# Altium schematic sheet Display.SchDoc
size A4; SheetNumber: 3; SheetTotal: 5
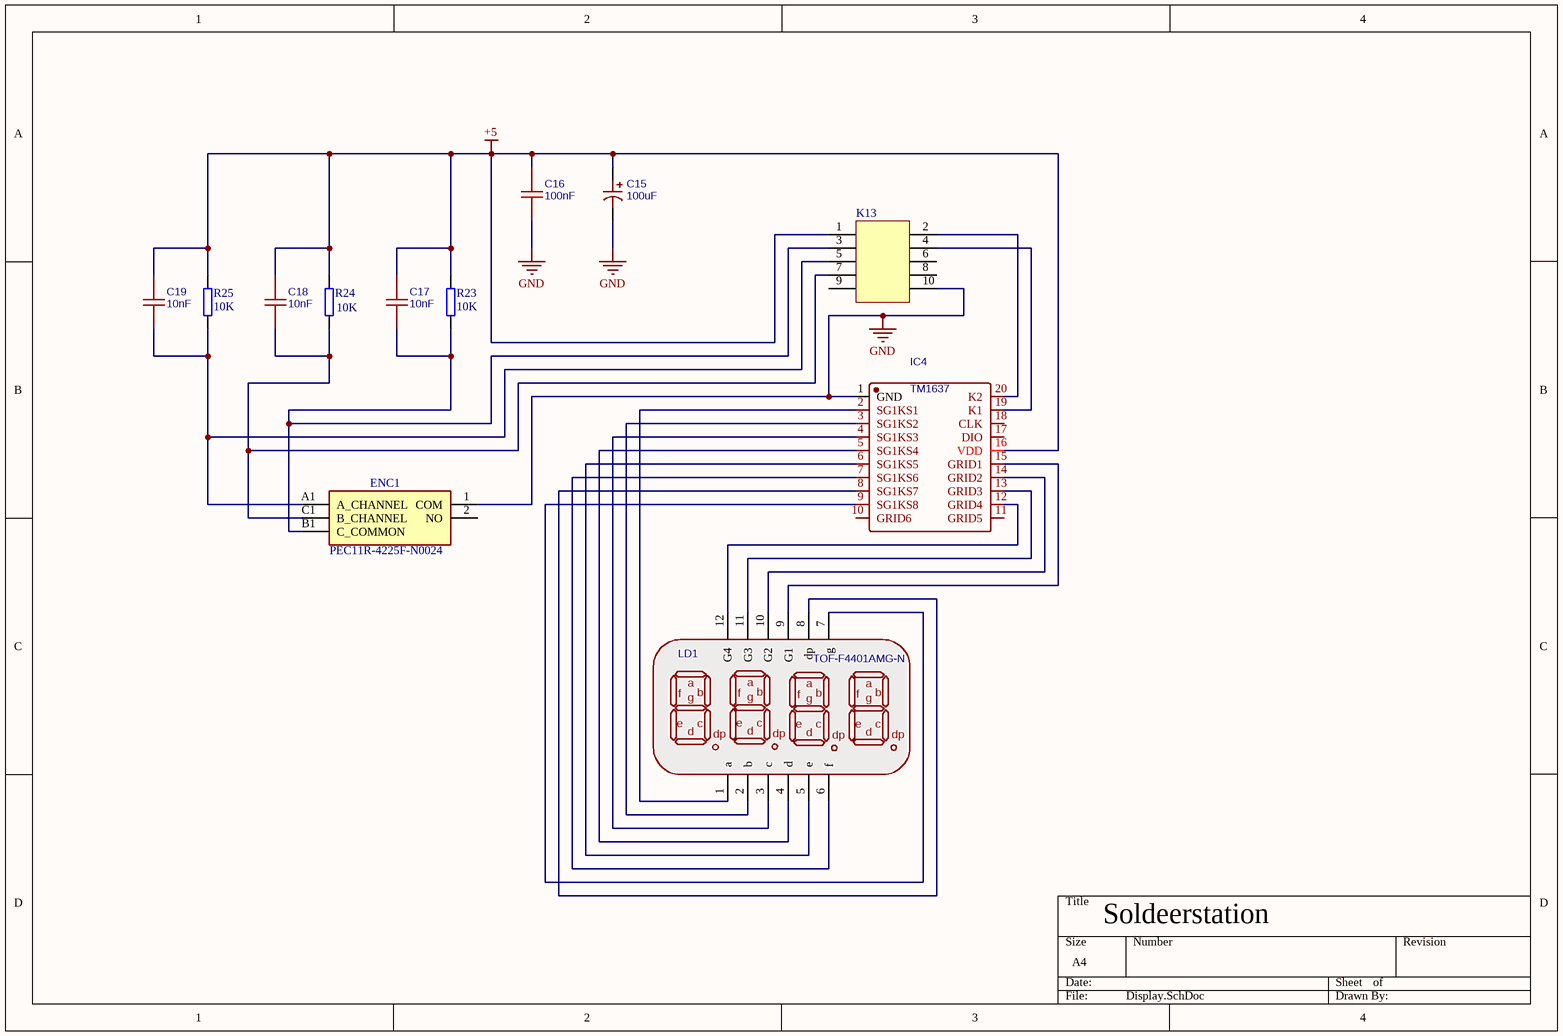
[diagram p0: Display.SchDoc]

## Parts
C15  100uF  [C4 100uF]
C16  100nF  [C6,7,12,13 10nF]
C17  10nF  [C6,7,12,13 10nF]
C18  10nF  [C6,7,12,13 10nF]
C19  10nF  [C6,7,12,13 10nF]
ENC1  PEC11R-4225F-N0024  [ENC1 draai encoder]
IC4  TM1637  [IC4 Led driver]
K13  (no value)  [BOxHeader_10]
LD1  TOF-F4401AMG-N  [LED1]
R23  10K  [RESC2013X50X30ML20T20]
R24  10K  [RESC2013X50X30ML20T20]
R25  10K  [RESC2013X50X30ML20T20]

## Nets
+5: C15.1 C16.2 C17.2 C18.2 C19.2 IC4.16(VDD) K13.1 R23.2 R24.2 R25.2
GND: C15.2 C16.1 ENC1.1(COM) IC4.1(GND) K13.10
NetC17_1: C17.1 ENC1.B1(C_COMMON) K13.3 R23.1
NetC18_1: C18.1 ENC1.C1(B_CHANNEL) K13.7 R24.1
NetC19_1: C19.1 ENC1.A1(A_CHANNEL) K13.5 R25.1
NetIC4_2: IC4.2(SG1KS1) LD1.1(a)
NetIC4_3: IC4.3(SG1KS2) LD1.2(b)
NetIC4_4: IC4.4(SG1KS3) LD1.3(c)
NetIC4_5: IC4.5(SG1KS4) LD1.4(d)
NetIC4_6: IC4.6(SG1KS5) LD1.5(e)
NetIC4_7: IC4.7(SG1KS6) LD1.6(f)
NetIC4_8: IC4.8(SG1KS7) LD1.8(dp)
NetIC4_9: IC4.9(SG1KS8) LD1.7(g)
NetIC4_12: IC4.12(GRID4) LD1.12(G4)
NetIC4_13: IC4.13(GRID3) LD1.11(G3)
NetIC4_14: IC4.14(GRID2) LD1.10(G2)
NetIC4_15: IC4.15(GRID1) LD1.9(G1)
NetIC4_19: IC4.19(K1) K13.4
NetIC4_20: IC4.20(K2) K13.2

Not connected (* = marked no-connect by the designer): ENC1 2(NO); IC4 10(GRID6) 11(GRID5) 17(DIO) 18(CLK); K13 6 8 9

## Notes on the sheet
- Soldeerstation

## Library data of the parts
C15 = C4 100uF: BOM_Manufacturer: Nichicon(尼吉康); BOM_Manufacturer Part: UWT1H101MNL1GS; Contributor: LCSC; nameAlias: Capacitance; BOM_Supplier: LCSC; BOM_Supplier Part: C445063; BOM_JLCPCB Part Class: Extended Part; spicePre: C; spiceSymbolName: UWT1H101MNL1GS
C16-C19 = C6,7,12,13 10nF: BOM_Manufacturer: CCTC(三环); BOM_Manufacturer Part: TCC0805X7R103M500DT; nameAlias: Capacitance; Contributor: LCSC; BOM_Supplier: LCSC; BOM_Supplier Part: C376921; BOM_JLCPCB Part Class: Extended Part; spicePre: C; spiceSymbolName: TCC0805X7R103M500DT
ENC1 = ENC1 Draai encoder: PEC11R-4225F-N0024Mechanical Encoder Rotary Incremental Flat 0.007N.m Straight Quadrature Digital Square Wave 24PPR Through Hole PC Pin; Manufacturer_Name: Bourns; Geometry.Height: 31.5mm; Mouser Part Number: 652-PEC11R-4225F-N24; Mouser Price/Stock: https://www.mouser.co.uk/ProductDetail/Bourns/PEC11R-4225F-N0024?qs=Zq5ylnUbLm6NTsWtgy%252B2Zg%3D%3D; Manufacturer_Part_Number: PEC11R-4225F-N0024; Datasheet Link: https://www.bourns.com/docs/Product-Datasheets/PEC11R.pdf
IC4 = IC4 Led driver: TM1637(TA2007); BOM_Manufacturer: TM(天微); Contributor: lcsc; BOM_Supplier: LCSC; BOM_Supplier Part: C5337160; BOM_Manufacturer Part: TM1637(TA2007); BOM_JLCPCB Part Class: Extended Part; spicePre: U; spiceSymbolName: TM1637(TA2007)
K13 = K Boxheader_10
LD1 = LED1: BOM_Manufacturer: OASIS(李洲); Contributor: LCSC; BOM_Supplier: LCSC; BOM_Supplier Part: C325426; BOM_Manufacturer Part: TOF-F4401AMG-N; BOM_JLCPCB Part Class: Extended Part; spicePre: L; spiceSymbolName: TOF-F4401AMG-N
R23-R25 = R Resistor: Manufacturer: Vishay Dale; Part Number: CRCW08050000Z0EA